# Altium project Quadcopter Fligth Controller Board.PrjPcb (part 5 of 7)

## Sheet Peripherals.SchDoc: Peripherals Sheet
size A3; Author: Kubilay Közleme; Organization: My Company; Address1: Address Line 1; Address2: Address Line 2; Address3: Address Line 3; Address4: Address Line 4; SheetNumber: 4; SheetTotal: 5; ProjectTitle: Drone Fligth Controller
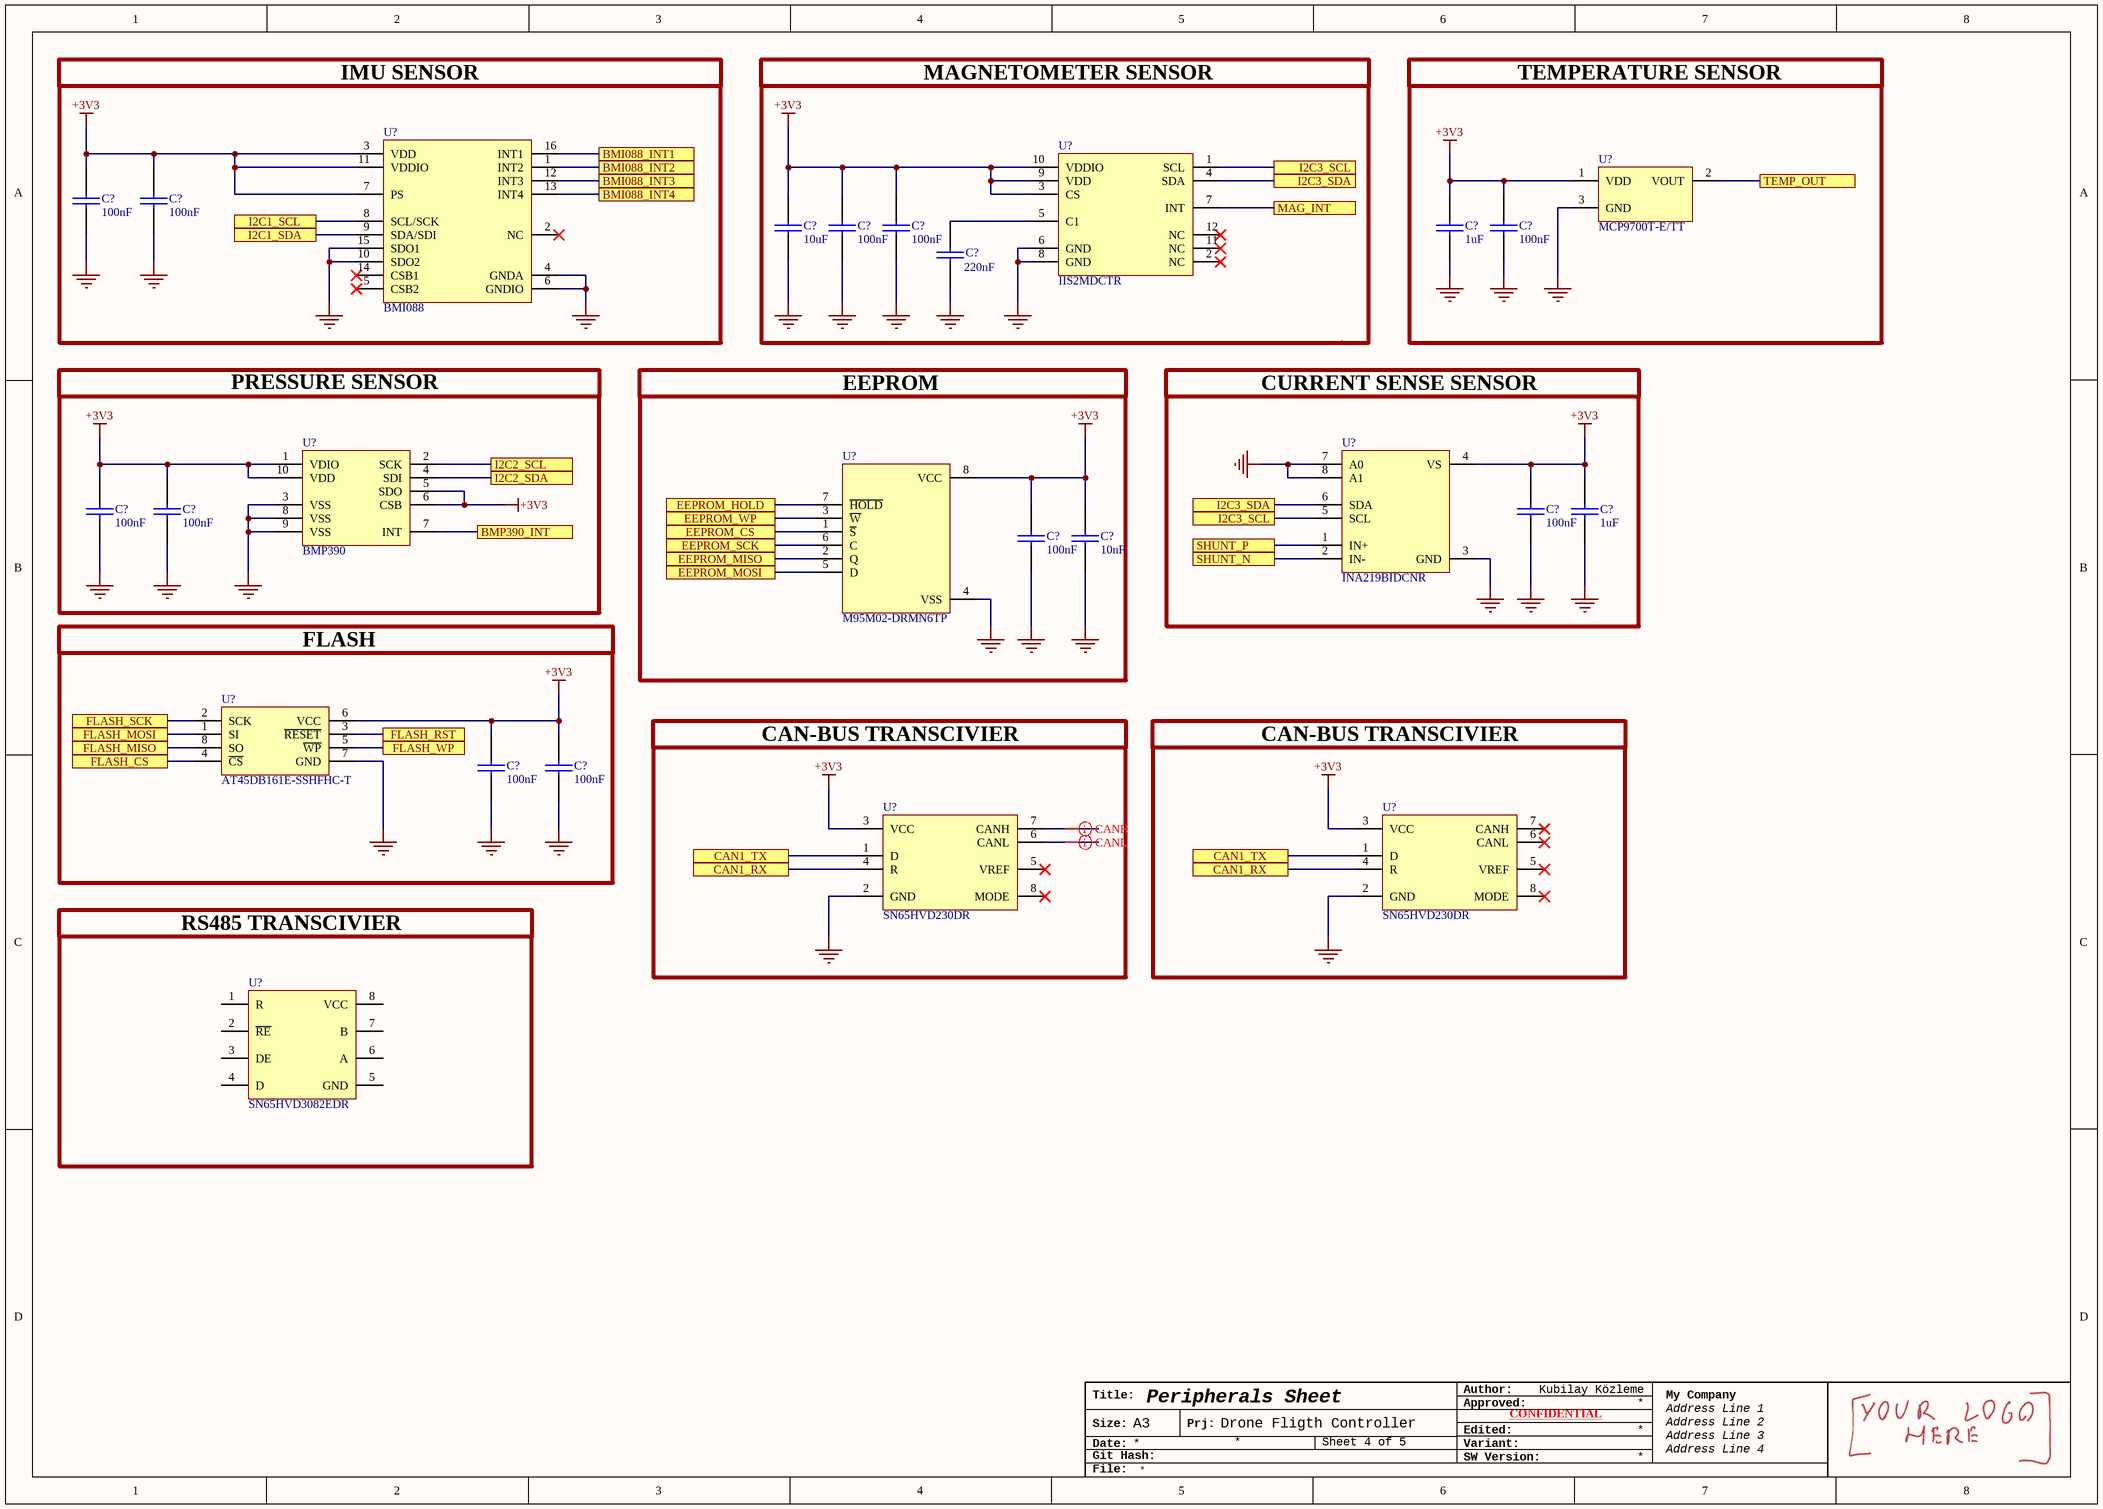
[diagram p2: Peripherals.SchDoc]

### Parts
(Parts that share a designator on the sheet are numbered #1, #2 ... from top to bottom, then left to right.)
C?#48  Capacitance: 220nF  [CAP_0603]  (hidden comment: 0603B224K160CT)
C?#49  Capacitance: 100nF  [CAP_0603]  (hidden comment: C0603C104K1RACTU)
C?#50  Capacitance: 100nF  [CAP_0603]  (hidden comment: C0603C104K1RACTU)
C?#51  value 10uF  [CAP_0603]  (hidden comment: ZRB18AR61C106ME01L)
C?#52  Capacitance: 100nF  [CAP_0603]  (hidden comment: C0603C104K1RACTU)
C?#53  Capacitance: 100nF  [CAP_0603]  (hidden comment: C0603C104K1RACTU)
C?#54  Capacitance: 1uF  [CAP_0805]  (hidden comment: CL21B105KBFNNNE)
C?#55  Capacitance: 100nF  [CAP_0603]  (hidden comment: C0603C104K1RACTU)
C?#56  Capacitance: 100nF  [CAP_0603]  (hidden comment: C0603C104K1RACTU)
C?#57  Capacitance: 100nF  [CAP_0603]  (hidden comment: C0603C104K1RACTU)
C?#58  Capacitance: 100nF  [CAP_0603]  (hidden comment: C0603C104K1RACTU)
C?#59  Capacitance: 1uF  [CAP_0805]  (hidden comment: CL21B105KBFNNNE)
C?#60  Capacitance: 100nF  [CAP_0603]  (hidden comment: C0603C104K1RACTU)
C?#61  value 10nF  [CAP_0603]  (hidden comment: 0603B103K160CT)
C?#62  Capacitance: 100nF  [CAP_0603]  (hidden comment: C0603C104K1RACTU)
C?#63  Capacitance: 100nF  [CAP_0603]  (hidden comment: C0603C104K1RACTU)
U?#5  BMI088  [BMI088]
U?#6  IIS2MDCTR  [IIS2MDCTR]
U?#7  MCP9700T-E/TT  [SOT-23-3]
U?#8  BMP390  [BMP390 - 10LGA]
U?#9  INA219BIDCNR  [SOT-23]
U?#10  M95M02-DRMN6TP  [SOIC-8]
U?#11  AT45DB161E-SSHFHC-T  [SOIC-8]
U?#12  SN65HVD230DR  [SOIC-8]
U?#13  SN65HVD230DR  [SOIC-8]
U?#14  SN65HVD3082EDR  [SOIC-8]

### Blocks framed on the sheet
IMU SENSOR: C?#49 C?#50 U?#5
MAGNETOMETER SENSOR: C?#48 C?#51-C?#53 U?#6
TEMPERATURE SENSOR: C?#54 C?#55 U?#7
PRESSURE SENSOR: C?#56 C?#57 U?#8
EEPROM: C?#60 C?#61 U?#10
CURRENT SENSE SENSOR: C?#58 C?#59 U?#9
FLASH: C?#62 C?#63 U?#11
CAN-BUS TRANSCIVIER: U?#12
CAN-BUS TRANSCIVIER: U?#13
RS485 TRANSCIVIER: U?#14

### Ports
BMI088_INT1 (see Microcontroller[1B]), BMI088_INT2 (see Microcontroller[1B]), BMI088_INT3 (see Microcontroller[1B]), BMI088_INT4 (see Microcontroller[1B]), BMP390_INT (see Microcontroller[1B]), CAN1_RX (see Peripherals[3C]), CAN1_RX (see Peripherals[5C]), CAN1_TX (see Peripherals[3C]), CAN1_TX (see Peripherals[5C]), EEPROM_CS (see Microcontroller[3B]), EEPROM_HOLD (see Microcontroller[3B]), EEPROM_MISO (see Microcontroller[3B]), EEPROM_MOSI (see Microcontroller[3B]), EEPROM_SCK (see Microcontroller[3B]), EEPROM_WP (see Microcontroller[3B]), FLASH_CS (see Microcontroller[3B]), FLASH_MISO (see Microcontroller[3B]), FLASH_MOSI (see Microcontroller[3B]), FLASH_RST (see Microcontroller[3B]), FLASH_SCK (see Microcontroller[3B]), FLASH_WP (see Microcontroller[3B]), I2C1_SCL (see Microcontroller[1B], Microcontroller[7B]), I2C1_SDA (see Microcontroller[1B], Microcontroller[7B]), I2C2_SCL (see Microcontroller[1B], Microcontroller[8B]), I2C2_SDA (see Microcontroller[1B], Microcontroller[7B]), I2C3_SCL (see Microcontroller[1B], Microcontroller[8B], Peripherals[5A]), I2C3_SCL (see Microcontroller[1B], Microcontroller[8B], Peripherals[5B]), I2C3_SDA (see Microcontroller[1B], Microcontroller[8B], Peripherals[5A]), I2C3_SDA (see Microcontroller[1B], Microcontroller[8B], Peripherals[5B]), MAG_INT (see Microcontroller[1B]), SHUNT_N (see Power[2B]), SHUNT_P (see Power[1B]), TEMP_OUT

### Nets
11.1V: U?#9.1(IN+) ; port SHUNT_P
+3V3: C?#49.2 C?#50.2 C?#51.2 C?#52.2 C?#53.2 C?#54.2 C?#55.2 C?#56.2 C?#57.2 C?#58.2 C?#59.2 C?#60.2 C?#61.2 C?#62.2 C?#63.2 U?#5.3(VDD) U?#5.7(PS) U?#5.11(VDDIO) U?#6.3(CS) U?#6.9(VDD) U?#6.10(VDDIO) U?#7.1(VDD) U?#8.1(VDIO) U?#8.5(SDO) U?#8.6(CSB) U?#8.10(VDD) U?#9.4(VS) U?#10.8(VCC) U?#11.6(VCC) U?#12.3(VCC) U?#13.3(VCC)
GND: C?#48.2 C?#49.1 C?#50.1 C?#51.1 C?#52.1 C?#53.1 C?#54.1 C?#55.1 C?#56.1 C?#57.1 C?#58.1 C?#59.1 C?#60.1 C?#61.1 C?#62.1 C?#63.1 U?#5.4(GNDA) U?#5.6(GNDIO) U?#5.10(SDO2) U?#5.15(SDO1) U?#6.6(GND) U?#6.8(GND) U?#7.3(GND) U?#8.3(VSS) U?#8.8(VSS) U?#8.9(VSS) U?#9.3(GND) U?#9.7(A0) U?#9.8(A1) U?#10.4(VSS) U?#11.7(GND) U?#12.2(GND) U?#13.2(GND)  [project net BUCK_GND1]
VIN_EMI: U?#9.2(IN-) ; port SHUNT_N
NetC?#48_1: C?#48.1 U?#6.5(C1)
NetR?#13_1: U?#5.9(SDA/SDI) ; port I2C1_SDA
NetR?#14_1: U?#5.8(SCL/SCK) ; port I2C1_SCL
NetR?#15_1: U?#8.4(SDI) ; port I2C2_SDA
NetR?#16_1: U?#8.2(SCK) ; port I2C2_SCL
NetR?#17_1: U?#6.4(SDA) U?#9.6(SDA) ; port I2C3_SDA
NetR?#18_1: U?#6.1(SCL) U?#9.5(SCL) ; port I2C3_SCL
NetU?#3_1: U?#11.2(SCK) ; port FLASH_SCK
NetU?#3_2: U?#11.3(~{RESET}) ; port FLASH_RST
NetU?#3_3: U?#11.4(~{CS}) ; port FLASH_CS
NetU?#3_4: U?#11.8(SO) ; port FLASH_MISO
NetU?#3_5: U?#11.1(SI) ; port FLASH_MOSI
NetU?#3_7: U?#11.5(~{WP}) ; port FLASH_WP
NetU?#3_29: U?#10.6(C) ; port EEPROM_SCK
NetU?#3_30: U?#10.2(Q) ; port EEPROM_MISO
NetU?#3_31: U?#10.5(D) ; port EEPROM_MOSI
NetU?#3_32: U?#10.7(~{HOLD}) ; port EEPROM_HOLD
NetU?#3_33: U?#10.3(~{W}) ; port EEPROM_WP
NetU?#3_34: U?#10.1(~{S}) ; port EEPROM_CS
NetU?#3_45: U?#8.7(INT) ; port BMP390_INT
NetU?#3_68: U?#6.7(INT) ; port MAG_INT
NetU?#3_88: U?#5.13(INT4) ; port BMI088_INT4
NetU?#3_89: U?#5.12(INT3) ; port BMI088_INT3
NetU?#3_90: U?#5.1(INT2) ; port BMI088_INT2
NetU?#3_91: U?#5.16(INT1) ; port BMI088_INT1
NetU?#7_2: U?#7.2(VOUT) ; port TEMP_OUT
NetU?#12_1: U?#12.1(D) U?#13.1(D) ; port CAN1_TX
NetU?#12_4: U?#12.4(R) U?#13.4(R) ; port CAN1_RX

Not connected (* = marked no-connect by the designer): U?#5 2(NC)* 5(CSB2)* 14(CSB1)*; U?#6 2(NC)* 11(NC)* 12(NC)*; U?#12 5(VREF)* 6(CANL) 7(CANH) 8(MODE)*; U?#13 5(VREF)* 6(CANL)* 7(CANH)* 8(MODE)*; U?#14 1(R) 2(~{RE}) 3(DE) 4(D) 5(GND) 6(A) 7(B) 8(VCC)

### Layout directives
differential pair; differential pair class CAN-BUS FD: NetU?#12_6, NetU?#12_7

### Notes on the sheet
- (near U?#6) CS Pini Neden 3V3 Bağlandı : Sensörün I2C haberleşmesi için
  Referans Tasarım UM3076 notu
- Title:
- Author:
- Approved:
- Size:
- Date:
- Git Hash:
- A3
- Prj:
- SW Version:
- Variant:
- Edited:
- CONFIDENTIAL
- File:

### Library data of the parts
C?#48 = CAP CER 220nF 0603: Ceramic Capacitor, Multilayer, Ceramic, 16V, 10% +Tol, 10% -Tol, X7R, 15% TC, 0.22uF, Surface Mount, 0603; Manufacturer: Walsin Technologies; Multilayer: Yes; Designed By: Kubilay Közleme; Supplier 1: Digikey; Manufacturer Part Number: 0603B224K160CT; RoHS: Yes; Category: Ceramic Capacitors; Stock 1: 99293; Pricing 1: 1=0.1, 10=0.034, 50=0.0192, 100=0.0149, 500=0.01124, 1000=0.00883 (USD); Mount: Surface Mount; Number of Pins: 2; Dielectric Material: Ceramic; Package Shape: Rectangular; Size Code: 0603; Terminal Finish: Nickel; Min Operating Temperature: -55°C; Max Operating Temperature: 125°C; JESD-609 Code: e3; Capacitor Type: Ceramic; Negative Tolerance: 10%; Package Style: SMTMeter; Packaging: Tape and Reel; Positive Tolerance: 10%; Rated DC Voltage (URdc): 16V; Temperature Characteristics Code: X7R; Termination: Wraparound; Length: 1.6mm; Width: 0.8mm; Height: 0.8mm; Reach SVHC Compliant: Yes; RoHS Compliant: Yes; ComponentLink1URL: https://datasheet.ciiva.com:443/pdfs/VipMasterIC/IC/WATC/WATC-S-A0009550342/WATC-S-A0009550342-1.pdf?src-supplier=IHS+Markit; ComponentLink1Description: https://datasheet.ciiva.com:443/pdfs/VipMasterIC/IC/WATC/WATC-S-A0009550342/WATC-S-A0009550342-1.pdf?src-supplier=IHS+Markit; ComponentLink2URL: http://www.farnell.com/datasheets/2340522.pdf?src-supplier=Farnell; ComponentLink2Description: http://www.farnell.com/datasheets/2340522.pdf?src-supplier=Farnell; ComponentLink3URL: http://www.farnell.com/datasheets/2009679.pdf?src-supplier=Farnell; ComponentLink3Description: http://www.farnell.com/datasheets/2009679.pdf?src-supplier=Farnell; ComponentLink4URL: https://www.verical.com/server-webapp/html/getDatasheet?partID=415742&src-supplier=Verical; ComponentLink4Description: https://www.verical.com/server-webapp/html/getDatasheet?partID=415742&src-supplier=Verical; ComponentLink5URL: http://www.passivecomponent.com/wp-content/uploads/2018/10/MLCC.pdf?src-supplier=Digikey; ComponentLink5Description: http://www.passivecomponent.com/wp-content/uploads/2018/10/MLCC.pdf?src-supplier=Digikey; ComponentLink6URL: https://datasheet.octopart.com/0603B224K160CT-Walsin-Technologies-datasheet-128065749.pdf?src-supplier=Future+Electronics; ComponentLink6Description: https://datasheet.octopart.com/0603B224K160CT-Walsin-Technologies-datasheet-128065749.pdf?src-supplier=Future+Electronics; ComponentLink7URL: https://datasheet.octopart.com/0603B224K160CT-Walsin-Technologies-datasheet-85392065.pdf?src-supplier=Element14; ComponentLink7Description: https://datasheet.octopart.com/0603B224K160CT-Walsin-Technologies-datasheet-85392065.pdf?src-supplier=Element14; ComponentLink8URL: https://datasheet.octopart.com/0603B224K160CT-Walsin-Technologies-datasheet-136037192.pdf?src-supplier=TECHDesign; ComponentLink8Description: https://datasheet.octopart.com/0603B224K160CT-Walsin-Technologies-datasheet-136037192.pdf?src-supplier=TECHDesign; ComponentLink9URL: https://datasheet.octopart.com/0603B224K160CT-Walsin-Technologies-datasheet-62066062.pdf?src-supplier=TME; ComponentLink9Description: https://datasheet.octopart.com/0603B224K160CT-Walsin-Technologies-datasheet-62066062.pdf?src-supplier=TME; Supplier Part Number 1: 1292-1419-1-ND
C?#49 C?#50 C?#52 C?#53 C?#55-C?#58 C?#60 C?#62 C?#63 = CAP CER 100nF 0603: Cap Cer 0603 0.1UF 100VDC X7R; Manufacturer: KEMET; Dielectric: 1511DielectricType; Voltage Rating (DC): 100V; Designed By: Kubilay Közleme; Supplier 1: Digikey; Manufacturer Part Number: C0603C104K1RACTU; RoHS: No; Category: Ceramic Capacitors; Stock 1: 10169; Pricing 1: 1=0.28, 10=0.185, 50=0.1296, 100=0.1047, 500=0.07782, 1000=0.06808 (USD); Case/Package: 345Case; Supplier Part Number 1: 399-C0603C104K1RACTUCT-ND
C?#51 = CAP CER 10uF 0603: Ceramic Capacitor, Multilayer, Ceramic, 16V, 20% +Tol, 20% -Tol, X5R, 15% TC, 10uF, Surface Mount, 0603; Manufacturer: Murata; Designed By: Kubilay Közleme; Supplier 1: Digikey; RoHS: Yes; Category: Ceramic Capacitors; Stock 1: 123060; Pricing 1: 1=0.48, 10=0.284, 50=0.2068, 100=0.1828, 500=0.14188, 1000=0.1291 (USD); Number of Pins: 2; Dielectric Material: Ceramic; Capacitor Type: Ceramic; Reach SVHC Compliant: Yes; RoHS Compliant: Yes; ComponentLink1URL: https://datasheet.ciiva.com:443/pdfs/VipMasterIC/IC/MURE/MURE-S-A0004380799/MURE-S-A0004414209-1.pdf?src-supplier=IHS+Markit; ComponentLink1Description: https://datasheet.ciiva.com:443/pdfs/VipMasterIC/IC/MURE/MURE-S-A0004380799/MURE-S-A0004414209-1.pdf?src-supplier=IHS+Markit; ComponentLink2URL: http://www.farnell.com/datasheets/2163235.pdf?src-supplier=Farnell; ComponentLink2Description: http://www.farnell.com/datasheets/2163235.pdf?src-supplier=Farnell; ComponentLink3URL: http://search.murata.co.jp/Ceramy/image/img/A01X/G101/ENG/ZRB18AR61C106ME01-01.pdf?src-supplier=Digikey; ComponentLink3Description: http://search.murata.co.jp/Ceramy/image/img/A01X/G101/ENG/ZRB18AR61C106ME01-01.pdf?src-supplier=Digikey; ComponentLink4URL: http://www.farnell.com/datasheets/2163235.pdf?src-supplier=Newark; ComponentLink4Description: http://www.farnell.com/datasheets/2163235.pdf?src-supplier=Newark; ComponentLink5URL: http://www.farnell.com/datasheets/2163235.pdf?src-supplier=Element14; ComponentLink5Description: http://www.farnell.com/datasheets/2163235.pdf?src-supplier=Element14; ComponentLink6URL: https://datasheet.octopart.com/ZRB18AR61C106ME01L-Murata-datasheet-62317488.pdf?src-supplier=Element14; ComponentLink6Description: https://datasheet.octopart.com/ZRB18AR61C106ME01L-Murata-datasheet-62317488.pdf?src-supplier=Element14; ComponentLink7URL: https://datasheet.octopart.com/ZRB18AR61C106ME01L-Murata-datasheet-67356777.pdf?src-supplier=Newark; ComponentLink7Description: https://datasheet.octopart.com/ZRB18AR61C106ME01L-Murata-datasheet-67356777.pdf?src-supplier=Newark; ComponentLink8URL: https://datasheet.octopart.com/ZRB18AR61C106ME01L-Murata-datasheet-86813782.pdf?src-supplier=Future+Electronics; ComponentLink8Description: https://datasheet.octopart.com/ZRB18AR61C106ME01L-Murata-datasheet-86813782.pdf?src-supplier=Future+Electronics; ComponentLink9URL: https://datasheet.octopart.com/ZRB18AR61C106ME01L-Murata-datasheet-166166242.pdf?src-supplier=TME; ComponentLink9Description: https://datasheet.octopart.com/ZRB18AR61C106ME01L-Murata-datasheet-166166242.pdf?src-supplier=TME; Supplier Part Number 1: 490-10990-6-ND; Manufacturer Part Number: ZRB18AR61C106ME01L
C?#54 C?#59 = CAP CER 1uF 0805: Multilayer Ceramic Capacitor, 1 uF, 50 V, ï¿½ 10%, X7R, 0805 [2012 Metric]; Manufacturer: Samsung; Voltage Rating (DC): 50V; Designed By: Kubilay Közleme; Supplier 1: Digikey; Manufacturer Part Number: CL21B105KBFNNNE; RoHS: Yes; Category: Ceramic Capacitors; Stock 1: 1081238; Pricing 1: 1=0.11, 10=0.075, 50=0.045, 100=0.0354, 500=0.02616, 1000=0.02165 (USD); Mount: Surface Mount; Case/Package: 0805; Material: Ceramic; Case Code (Metric): 2012; Case Code (Imperial): 0805; Min Operating Temperature: -55°C; Max Operating Temperature: 125°C; Tolerance: 10%; Packaging: Tape and Reel; Package Quantity: 1; Voltage Rating: 50V; Dielectric: X7R; Voltage: 50V; Series: CL; Construction: Flat; Length: 2mm; Width: 0.049inch; Height: 1.25mm; Thickness: 0.053inch; Depth: 1.25mm; Radiation Hardening: No; RoHS Compliant: Yes; ComponentLink1URL: https://datasheet.ciiva.com/25800/cl21b105kbfnnne-25800291.pdf?src-supplier=Digikey; ComponentLink1Description: https://datasheet.ciiva.com/25800/cl21b105kbfnnne-25800291.pdf?src-supplier=Digikey; Supplier Part Number 1: 1276-1029-1-ND
C?#61 = CAP CER 10nF 0603: 0603 16V X7R .01uF 10% multilayer ceramic capacitor; Manufacturer: Walsin Technologies; Designed By: Kubilay Közleme; Supplier 1: Digikey; Manufacturer Part Number: 0603B103K160CT; RoHS: Yes; Category: Ceramic Capacitors; Stock 1: 65786; Pricing 1: 1=0.1, 10=0.031, 50=0.018, 100=0.0139, 500=0.0105, 1000=0.00825 (USD); Lead Free: 5697LeadFree; ComponentLink1URL: http://www.farnell.com/datasheets/1958513.pdf?src-supplier=Farnell; ComponentLink1Description: http://www.farnell.com/datasheets/1958513.pdf?src-supplier=Farnell; ComponentLink2URL: https://datasheet.octopart.com/0603B103K160CT-Walsin-Technologies-datasheet-136037192.pdf?src-supplier=Future+Electronics; ComponentLink2Description: https://datasheet.octopart.com/0603B103K160CT-Walsin-Technologies-datasheet-136037192.pdf?src-supplier=Future+Electronics; ComponentLink3URL: http://www.passivecomponent.com/wp-content/uploads/2018/10/MLCC.pdf?src-supplier=Digikey; ComponentLink3Description: http://www.passivecomponent.com/wp-content/uploads/2018/10/MLCC.pdf?src-supplier=Digikey; ComponentLink4URL: https://datasheet.octopart.com/0603B103K160CT-Walsin-Technologies-datasheet-85392065.pdf?src-supplier=Element14; ComponentLink4Description: https://datasheet.octopart.com/0603B103K160CT-Walsin-Technologies-datasheet-85392065.pdf?src-supplier=Element14; ComponentLink5URL: https://datasheet.octopart.com/0603B103K160CT-Walsin-Technologies-datasheet-62066062.pdf?src-supplier=TME; ComponentLink5Description: https://datasheet.octopart.com/0603B103K160CT-Walsin-Technologies-datasheet-62066062.pdf?src-supplier=TME; Supplier Part Number 1: 1292-1384-1-ND
U?#5 = BMI088: BMI088 Series 3.6 V 6 Axis Digital Output Accelerometer Motion Sensor - LGA-16; Manufacturer: Bosch Tools; Designed By: Kubilay Közleme; Supplier 1: Digikey; RoHS: No; Category: Linear ICs; Stock 1: 2439; Pricing 1: 1=6.94, 5=5.854, 10=5.44, 25=4.9368, 50=4.5878, 100=4.2636, 500=3.59692, 1000=3.34313 (USD); ComponentLink1URL: https://ae-bst.resource.bosch.com/media/_tech/media/product_flyer/Bosch_Sensortec_Product_flyer_BMI088.pdf?src-supplier=Digikey; ComponentLink1Description: https://ae-bst.resource.bosch.com/media/_tech/media/product_flyer/Bosch_Sensortec_Product_flyer_BMI088.pdf?src-supplier=Digikey; ComponentLink2URL: https://ae-bst.resource.bosch.com/media/_tech/media/application_notes/BST-MIS-HS001.pdf?src-supplier=Digikey; ComponentLink2Description: https://ae-bst.resource.bosch.com/media/_tech/media/application_notes/BST-MIS-HS001.pdf?src-supplier=Digikey; Supplier Part Number 1: 828-1082-1-ND; Manufacturer Part Number: BMI088
U?#6 = IIS2MDCTR: Analog Circuit, 1 Func, PBGA12; Manufacturer: STMicroelectronics; Designed By: Kubilay Közleme; Supplier 1: Digikey; Manufacturer Part Number: IIS2MDCTR; RoHS: Yes; Category: Inertial Measurement Units (IMUs); Stock 1: 20000; Pricing 1: 10000=1.5138 (USD); Terminal Finish: Nickel; JESD-609 Code: e4; Analog IC - Other Type: ANALOG CIRCUIT; Moisture Sensitivity Level: 3; Reach SVHC Compliant: Yes; RoHS Compliant: Yes; ComponentLink1URL: https://datasheet.ciiva.com:443/pdfs/VipMasterIC/IC/SGST/SGST-S-A0005002799/SGST-S-A0005002799-1.pdf?src-supplier=IHS+Markit; ComponentLink1Description: https://datasheet.ciiva.com:443/pdfs/VipMasterIC/IC/SGST/SGST-S-A0005002799/SGST-S-A0005002799-1.pdf?src-supplier=IHS+Markit; ComponentLink2URL: http://www.farnell.com/datasheets/2600071.pdf?src-supplier=Farnell; ComponentLink2Description: http://www.farnell.com/datasheets/2600071.pdf?src-supplier=Farnell; ComponentLink3URL: http://www.st.com/content/ccc/resource/technical/document/datasheet/group3/06/f2/a3/a7/74/fe/4b/16/DM00431721/files/DM00431721.pdf/jcr:content/translations/en.DM00431721.pdf?src-supplier=Digikey; ComponentLink3Description: http://www.st.com/content/ccc/resource/technical/document/datasheet/group3/06/f2/a3/a7/74/fe/4b/16/DM00431721/files/DM00431721.pdf/jcr:content/translations/en.DM00431721.pdf?src-supplier=Digikey; ComponentLink4URL: http://www.farnell.com/datasheets/2600071.pdf?src-supplier=Newark; ComponentLink4Description: http://www.farnell.com/datasheets/2600071.pdf?src-supplier=Newark; Supplier Part Number 1: 497-17728-2-ND
U?#7 = MCP9700T-E/TT: Analog Voltage Output Sensor, 12 Bit(s), 6Cel, Rectangular, 3 Pin, Surface Mount; Manufacturer: Microchip; Package Body Material: Plastic; Accuracy-Max (Cel): 4°C; Linearity (Cel): 0.5°C; Operating Current-Max: 12uA; Package Equivalence Code: TO-236; Power Supplies: 2.5/5V; Sensors/Transducers Type: TEMPERATURE SENSOR,ANALOG,VOLTAGE OUTPUT; Max Supply Voltage: 5.5V; Min Supply Voltage: 2.3V; Body Breadth: 1.3inch; Body Height: 1.01mm; Body Length or Diameter: 2.9mm; Designed By: Kubilay Közleme; Supplier 1: Digikey; Manufacturer Part Number: MCP9700T-E/TT; RoHS: Yes; Category: Temperature and Humidity Sensors; Stock 1: 292525; Pricing 1: 1=0.3, 25=0.24, 100=0.22 (USD); Mount: Surface Mount; Number of Pins: 3; Housing Material: Plastic; Package Shape/Style: Rectangular; Terminal Finish: Tin; Min Operating Temperature: -40°C; Max Operating Temperature: 125°C; JESD-609 Code: e3; Termination: Solder; Reach SVHC Compliant: Yes; RoHS Compliant: Yes; ComponentLink1URL: https://datasheet.ciiva.com:443/pdfs/VipMasterIC/IC/MCHP/MCHP-S-A0002133400/MCHP-S-A0002133400-1.pdf?src-supplier=IHS+Markit; ComponentLink1Description: https://datasheet.ciiva.com:443/pdfs/VipMasterIC/IC/MCHP/MCHP-S-A0002133400/MCHP-S-A0002133400-1.pdf?src-supplier=IHS+Markit; ComponentLink2URL: https://datasheet.ciiva.com/2847/21942e-2847060.pdf?src-supplier=Digikey; ComponentLink2Description: https://datasheet.ciiva.com/2847/21942e-2847060.pdf?src-supplier=Digikey; ComponentLink3URL: https://datasheet.ciiva.com/2847/21942e-2847061.pdf?src-supplier=Digikey; ComponentLink3Description: https://datasheet.ciiva.com/2847/21942e-2847061.pdf?src-supplier=Digikey; ComponentLink4URL: https://datasheet.ciiva.com/2847/21942e-2847062.pdf?src-supplier=Digikey; ComponentLink4Description: https://datasheet.ciiva.com/2847/21942e-2847062.pdf?src-supplier=Digikey; ComponentLink5URL: https://datasheet.ciiva.com/26344/651535-da-01-en-ic-sens-th-mcp9700t-e-tt-sot-23-3-mcp-26344471.pdf?src-supplier=Conrad; ComponentLink5Description: https://datasheet.ciiva.com/26344/651535-da-01-en-ic-sens-th-mcp9700t-e-tt-sot-23-3-mcp-26344471.pdf?src-supplier=Conrad; Supplier Part Number 1: MCP9700T-E/TTDKR-ND
U?#8 = BMP390: Board Mount Pressure Sensor 300hPa to 1250hPa Barometric 10-Pin LGA Module T/R; Manufacturer: Bosch Tools; Designed By: Kubilay Közleme; Supplier 1: Digikey; RoHS: No; Category: Linear ICs; Stock 1: 20995; Pricing 1: 1=4.17, 5=3.512, 10=3.264, 25=2.9616, 50=2.752, 100=2.5575, 500=2.15742, 1000=2.00514, 5000=1.7 (USD); Supplier Part Number 1: 828-BMP390CT-ND; Manufacturer Part Number: BMP390
U?#9 = INA219BIDCNR: Power Supply Support Circuit, Fixed, 2 Channel, 2, PDSO8; Manufacturer: Texas Instruments; Package Body Material: Plastic; Adjustable Threshold: No; Number of Channels: 2; Number of Functions: 1; Power Supplies: 3.3V; Supply Current-Max (Isup): 1mA; Supply Voltage-Max (Vsup): 5.5V; Supply Voltage-Min (Vsup): 3V; Package Equivalence Code: TSSOP8,.1; Qualification Status: Not Qualified; Designed By: Kubilay Közleme; Supplier 1: Digikey; Manufacturer Part Number: INA219BIDCNR; RoHS: Yes; Category: Amplifiers - Op Amps, Buffer, Instrumentation; Stock 1: 14409; Pricing 1: 1=1.98, 10=1.423, 25=1.284, 100=1.1862 (USD); Package Code: LSSOP; Number of Pins: 8; Package Shape: Rectangular; Terminal Finish: Nickel; Min Operating Temperature: -40°C; Max Operating Temperature: 125°C; JESD-609 Code: e4; Analog IC - Other Type: POWER SUPPLY SUPPORT CIRCUIT; Moisture Sensitivity Level: 2; Package Style: SMALL OUTLINE, LOW PROFILE, SHRINK PITCHMeter; Peak Reflow Temperature (Cel): 260°C; Supply Voltage-Nom (Vsup): 3.3V; Surface Mount: Yes; Terminal Form: Gull Wing; Terminal Position: DUAL; JESD-30 Code: R-PDSO-G8; Length: 2.9mm; Width: 1.6mm; Height - Seated (Max): 1.45mm; Terminal Pitch: 0.65mm; Temperature Grade: AUTOMOTIVE; Reach SVHC Compliant: Yes; RoHS Compliant: Yes; ComponentLink1URL: https://www.ti.com:443/lit/ds/symlink/ina219.pdf?src-supplier=IHS+Markit; ComponentLink1Description: https://www.ti.com:443/lit/ds/symlink/ina219.pdf?src-supplier=IHS+Markit; ComponentLink2URL: https://datasheet.ciiva.com/1940/ina219-1940043.pdf?src-supplier=Digikey; ComponentLink2Description: https://datasheet.ciiva.com/1940/ina219-1940043.pdf?src-supplier=Digikey; ComponentLink3URL: https://datasheet.ciiva.com/2965/ina219-2965729.pdf?src-supplier=Avnet; ComponentLink3Description: https://datasheet.ciiva.com/2965/ina219-2965729.pdf?src-supplier=Avnet; Supplier Part Number 1: 296-46420-6-ND
U?#10 = M95M02-DRMN6TP: EEPROM, 256KX8, Serial, CMOS, PDSO8; Manufacturer: STMicroelectronics; Package Body Material: Plastic; Clock Frequency-Max (fCLK): 5MHz; Data Retention Time-Min: 200; Endurance: 4000000Cycles; Density: 2097152b; Memory Width: 8; Number of Functions: 1; Number of Words: 262144; Number of Words Code: 256K; Operating Mode: SYNCHRONOUS; Package Equivalence Code: SOP8,.25; Power Supplies: 2.5V; Serial Bus Type: SPI; Standby Current-Max: 3uA; Supply Voltage-Max (Vsup): 5.5V; Supply Voltage-Min (Vsup): 1.8V; Write Cycle Time-Max (tWC): 10ms; Write Protection: HARDWARE/SOFTWARE; Qualification Status: Not Qualified; Designed By: Kubilay Közleme; Supplier 1: Digikey; Manufacturer Part Number: M95M02-DRMN6TP; RoHS: Yes; Category: EEPROM; Stock 1: 45577; Pricing 1: 1=2.19, 10=1.965, 25=1.9344, 50=1.9294, 100=1.7241, 250=1.66744, 500=1.66138, 1000=1.54704 (USD); Package Code: SOP; Number of Pins: 8; Package Shape: Rectangular; Terminal Finish: Nickel; Min Operating Temperature: -40°C; Max Operating Temperature: 85°C; JESD-609 Code: e4; Memory Type: EEPROM; JESD-30 Code: R-PDSO-G8; Moisture Sensitivity Level: 1; Organization: 256KX8; Package Style: SMALL OUTLINEMeter; Parallel/Serial: SERIAL; Peak Reflow Temperature (Cel): 260°C; Max Supply Current: 3uA; Supply Voltage-Nom (Vsup): 2.5V; Surface Mount: Yes; Technology: CMOS; Terminal Form: Gull Wing; Terminal Position: DUAL; Length: 4.9mm; Width: 3.9mm; Height - Seated (Max): 1.75mm; Terminal Pitch: 1.27mm; Temperature Grade: INDUSTRIAL; Reach SVHC Compliant: Yes; RoHS Compliant: Yes; ComponentLink1URL: https://datasheet.ciiva.com:443/pdfs/VipMasterIC/IC/SGST/SGST-S-A0001365047/SGST-S-A0001365047-1.pdf?src-supplier=IHS+Markit; ComponentLink1Description: https://datasheet.ciiva.com:443/pdfs/VipMasterIC/IC/SGST/SGST-S-A0001365047/SGST-S-A0001365047-1.pdf?src-supplier=IHS+Markit; ComponentLink2URL: https://datasheet.ciiva.com/13035/cd00290531-117690-13035358.pdf?src-supplier=Mouser; ComponentLink2Description: https://datasheet.ciiva.com/13035/cd00290531-117690-13035358.pdf?src-supplier=Mouser; ComponentLink3URL: https://datasheet.ciiva.com/15123/getdatasheetpartid-326892-15123396.pdf?src-supplier=Verical; ComponentLink3Description: https://datasheet.ciiva.com/15123/getdatasheetpartid-326892-15123396.pdf?src-supplier=Verical; ComponentLink4URL: https://datasheet.ciiva.com/1905/cd00290531-1905403.pdf?src-supplier=Digikey; ComponentLink4Description: https://datasheet.ciiva.com/1905/cd00290531-1905403.pdf?src-supplier=Digikey; ComponentLink5URL: https://datasheet.ciiva.com/1905/cd00290531-1905404.pdf?src-supplier=Digikey; ComponentLink5Description: https://datasheet.ciiva.com/1905/cd00290531-1905404.pdf?src-supplier=Digikey; ComponentLink6URL: https://datasheet.ciiva.com/16445/cd00290531-16445533.pdf?src-supplier=Future+Electronics; ComponentLink6Description: https://datasheet.ciiva.com/16445/cd00290531-16445533.pdf?src-supplier=Future+Electronics; Supplier Part Number 1: 497-11405-1-ND
U?#11 = AT45DB161E-SSHFHC-T: IC FLASH 16MBIT SPI 85MHZ 8SOIC; Manufacturer: Renesas; Designed By: Kubilay Közleme; Supplier 1: Digikey; Manufacturer Part Number: AT45DB161E-SSHFHC-T; RoHS: No; Stock 1: 95294; Pricing 1: 1=2.85, 10=2.566, 25=2.526, 50=2.5196, 100=2.2513, 250=2.17732, 500=2.16942, 1000=2.02012 (USD); ComponentLink1URL: https://datasheet.ciiva.com:443/pdfs/VipMasterIC/IC/DIAL/DIAL-S-A0012811765/DIAL-S-A0012903641-1.pdf?src-supplier=IHS+Markit; ComponentLink1Description: https://datasheet.ciiva.com:443/pdfs/VipMasterIC/IC/DIAL/DIAL-S-A0012811765/DIAL-S-A0012903641-1.pdf?src-supplier=IHS+Markit; Supplier Part Number 1: AT45DB161E-SSHFHC-TDKR-ND
U?#12 U?#13 = SN65HVD230DR: Interface Circuit, 1-Trnsvr, BICMOS, PDSO8; Manufacturer: Texas Instruments; Package Body Material: Plastic; Data Rate: 1000Mbps; Number of Functions: 1; Package Equivalence Code: SOP8,.25; Power Supplies: 3.3V; Max Supply Current: 17uA; Qualification Status: Not Qualified; Designed By: Kubilay Közleme; Supplier 1: Digikey; RoHS: Yes; Category: Interface ICs; Stock 1: 20000; Pricing 1: 2500=1.13704, 5000=1.10839, 7500=1.09405 (USD); Package Code: SOP; Number of Pins: 8; Package Shape: Rectangular; Terminal Finish: Nickel; Min Operating Temperature: -40°C; Max Operating Temperature: 85°C; JESD-609 Code: e4; JESD-30 Code: R-PDSO-G8; Moisture Sensitivity Level: 1; Number of Transceivers: 1; Package Style: SMALL OUTLINEMeter; Peak Reflow Temperature (Cel): 260°C; Supply Voltage-Nom: 3.3V; Surface Mount: Yes; Technology: BICMOS; Telecom IC Type: INTERFACE CIRCUIT; Terminal Form: Gull Wing; Terminal Position: DUAL; Length: 4.9mm; Width: 3.9mm; Height - Seated (Max): 1.75mm; Terminal Pitch: 1.27mm; Temperature Grade: INDUSTRIAL; Reach SVHC Compliant: Yes; RoHS Compliant: Yes; ComponentLink1URL: https://www.ti.com:443/lit/ds/symlink/sn65hvd230.pdf?src-supplier=IHS+Markit; ComponentLink1Description: https://www.ti.com:443/lit/ds/symlink/sn65hvd230.pdf?src-supplier=IHS+Markit; ComponentLink2URL: https://datasheet.ciiva.com/3303/slos346k-3303008.pdf?src-supplier=Avnet; ComponentLink2Description: https://datasheet.ciiva.com/3303/slos346k-3303008.pdf?src-supplier=Avnet; ComponentLink3URL: https://datasheet.ciiva.com/28652/1695240-28652369.pdf?src-supplier=Element14; ComponentLink3Description: https://datasheet.ciiva.com/28652/1695240-28652369.pdf?src-supplier=Element14; ComponentLink4URL: https://datasheet.ciiva.com/4781/sn65hvd230-86923-4781328.pdf?src-supplier=Mouser; ComponentLink4Description: https://datasheet.ciiva.com/4781/sn65hvd230-86923-4781328.pdf?src-supplier=Mouser; ComponentLink5URL: https://datasheet.ciiva.com/27052/1495682-27052294.pdf?src-supplier=Jameco; ComponentLink5Description: https://datasheet.ciiva.com/27052/1495682-27052294.pdf?src-supplier=Jameco; ComponentLink6URL: https://datasheet.ciiva.com/22694/1887486-22694362.pdf?src-supplier=Element14; ComponentLink6Description: https://datasheet.ciiva.com/22694/1887486-22694362.pdf?src-supplier=Element14; ComponentLink7URL: https://datasheet.ciiva.com/1705/sn65hvd230-1705286.pdf?src-supplier=Digikey; ComponentLink7Description: https://datasheet.ciiva.com/1705/sn65hvd230-1705286.pdf?src-supplier=Digikey; ComponentLink8URL: https://datasheet.ciiva.com/1705/sn65hvd230-1705287.pdf?src-supplier=Digikey; ComponentLink8Description: https://datasheet.ciiva.com/1705/sn65hvd230-1705287.pdf?src-supplier=Digikey; ComponentLink9URL: https://datasheet.ciiva.com/1705/sn65hvd230-1705288.pdf?src-supplier=Digikey; ComponentLink9Description: https://datasheet.ciiva.com/1705/sn65hvd230-1705288.pdf?src-supplier=Digikey; ComponentLink10URL: https://datasheet.ciiva.com/15150/getdatasheetpartid-393721-15150028.pdf?src-supplier=Verical; ComponentLink10Description: https://datasheet.ciiva.com/15150/getdatasheetpartid-393721-15150028.pdf?src-supplier=Verical; Supplier Part Number 1: 296-11654-2-ND; Manufacturer Part Number: SN65HVD230DR
U?#14 = SN65HVD3082EDR: Line Transceiver, 1 Func, 1 Driver, 1 Rcvr, CMOS, PDSO8; Manufacturer: Texas Instruments; Package Body Material: Plastic; Differential Output: Yes; Driver Number of Bits: 1; High Level Input Current-Max: 100uA; Input Characteristics: DIFFERENTIAL SCHMITT TRIGGER; Out Swing-Min: 1.5V; Output Low Current-Max: 8mA; Package Equivalence Code: SOP8,.25; Power Supplies: 5V; Receive Delay-Max: 200ns; Max Supply Current: 900uA; Max Supply Voltage: 5.5V; Min Supply Voltage: 4.5V; Transmit Delay-Max: 1300ns; Qualification Status: Not Qualified; Designed By: Kubilay Közleme; Supplier 1: Digikey; RoHS: Yes; Category: RS-232 / RS-422 / RS-485 Interface ICs; Stock 1: 15000; Pricing 1: 2500=0.38894, 5000=0.37711, 7500=0.37119, 12500=0.36462, 17500=0.36078, 25000=0.35709 (USD); Package Code: SOP; Number of Pins: 8; Package Shape: Rectangular; Terminal Finish: Nickel; Min Operating Temperature: -40°C; Max Operating Temperature: 85°C; JESD-609 Code: e4; Interface IC Type: LINE TRANSCEIVER; JESD-30 Code: R-PDSO-G8; Moisture Sensitivity Level: 1; Number of Functions: 1; Package Style: SMALL OUTLINEMeter; Peak Reflow Temperature (Cel): 260°C; Receiver Number of Bits: 1; Supply Voltage-Nom: 5V; Surface Mount: Yes; Technology: CMOS; Terminal Form: Gull Wing; Terminal Position: DUAL; Length: 4.9mm; Width: 3.9mm; Height - Seated (Max): 1.75mm; Terminal Pitch: 1.27mm; Temperature Grade: INDUSTRIAL; Reach SVHC Compliant: Yes; RoHS Compliant: Yes; ComponentLink1URL: https://www.ti.com:443/lit/ds/symlink/sn65hvd3082e.pdf?src-supplier=IHS+Markit; ComponentLink1Description: https://www.ti.com:443/lit/ds/symlink/sn65hvd3082e.pdf?src-supplier=IHS+Markit; ComponentLink2URL: https://datasheet.ciiva.com/34302/1495851-34302335.pdf?src-supplier=Jameco; ComponentLink2Description: https://datasheet.ciiva.com/34302/1495851-34302335.pdf?src-supplier=Jameco; ComponentLink3URL: https://datasheet.ciiva.com/8064/1874612-8064621.pdf?src-supplier=Element14; ComponentLink3Description: https://datasheet.ciiva.com/8064/1874612-8064621.pdf?src-supplier=Element14; ComponentLink4URL: https://datasheet.ciiva.com/46396/1874612-46396477.pdf?src-supplier=Element14; ComponentLink4Description: https://datasheet.ciiva.com/46396/1874612-46396477.pdf?src-supplier=Element14; ComponentLink5URL: https://datasheet.ciiva.com/46396/1874612-46396457.pdf?src-supplier=Element14; ComponentLink5Description: https://datasheet.ciiva.com/46396/1874612-46396457.pdf?src-supplier=Element14; ComponentLink6URL: https://datasheet.ciiva.com/6635/sn65hvd3082e-6635718.pdf?src-supplier=Digikey; ComponentLink6Description: https://datasheet.ciiva.com/6635/sn65hvd3082e-6635718.pdf?src-supplier=Digikey; ComponentLink7URL: https://datasheet.ciiva.com/6635/sn65hvd3082e-6635721.pdf?src-supplier=Digikey; ComponentLink7Description: https://datasheet.ciiva.com/6635/sn65hvd3082e-6635721.pdf?src-supplier=Digikey; Supplier Part Number 1: 296-31719-2-ND; Manufacturer Part Number: SN65HVD3082EDR